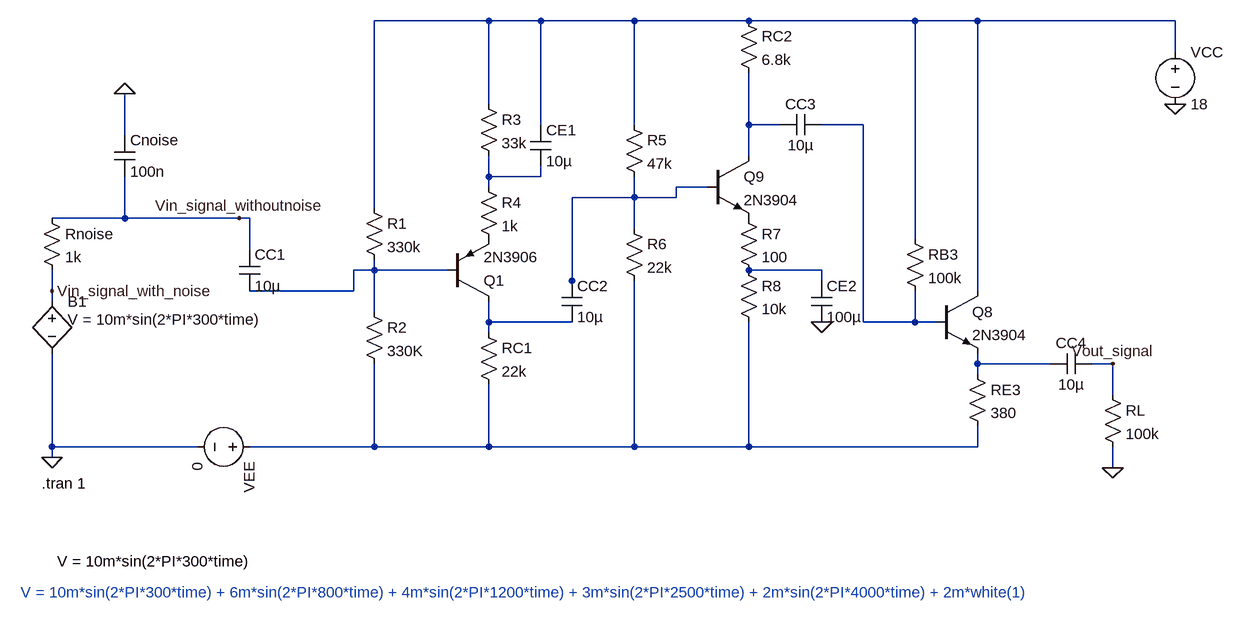
[diagram p0: schematic BJT_Audio_Amp_NoWires.asc]
BJT_Audio_Amp_NoWires.asc, the LTspice schematic file:
Version 4
SHEET 1 1736 1444
WIRE 208 80 32 80
WIRE 288 80 208 80
WIRE 432 80 288 80
WIRE 608 80 432 80
WIRE 864 80 608 80
WIRE 960 80 864 80
WIRE 1264 80 960 80
WIRE 1264 128 1264 80
WIRE 208 208 208 80
WIRE 288 240 288 80
WIRE 432 240 432 80
WIRE 608 240 608 160
WIRE 656 240 608 240
WIRE 784 240 720 240
WIRE -352 256 -352 192
WIRE 608 288 608 240
WIRE 208 320 208 288
WIRE 288 320 288 304
WIRE 288 320 208 320
WIRE 208 336 208 320
WIRE 544 336 496 336
WIRE 432 352 432 320
WIRE 432 352 336 352
WIRE 496 352 496 336
WIRE 496 352 432 352
WIRE 32 368 32 80
WIRE -352 384 -352 320
WIRE -352 384 -464 384
WIRE -176 384 -352 384
WIRE -160 384 -176 384
WIRE 432 400 432 352
WIRE 864 416 864 80
WIRE -160 432 -160 384
WIRE 32 464 32 448
WIRE 32 464 0 464
WIRE 144 464 32 464
WIRE 720 464 608 464
WIRE 336 480 336 352
WIRE 720 480 720 464
WIRE -464 496 -464 464
WIRE 0 496 0 464
WIRE 0 496 -160 496
WIRE 336 496 336 480
WIRE 960 496 960 80
WIRE -464 512 -464 496
WIRE 32 528 32 464
WIRE 208 544 208 512
WIRE 336 544 208 544
WIRE 784 544 784 240
WIRE 864 544 864 496
WIRE 864 544 784 544
WIRE 896 544 864 544
WIRE 208 560 208 544
WIRE 960 608 960 592
WIRE 1072 608 960 608
WIRE 1168 608 1136 608
WIRE 960 624 960 608
WIRE 1168 656 1168 608
WIRE -464 736 -464 592
WIRE -240 736 -464 736
WIRE 32 736 32 608
WIRE 32 736 -160 736
WIRE 208 736 208 640
WIRE 208 736 32 736
WIRE 432 736 432 480
WIRE 432 736 208 736
WIRE 608 736 608 544
WIRE 608 736 432 736
WIRE 960 736 960 704
WIRE 960 736 608 736
WIRE -464 752 -464 736
WIRE 1168 768 1168 736
FLAG 720 544 0
FLAG 1264 208 0
FLAG 1168 768 0
FLAG -464 752 0
FLAG -352 192 0
FLAG -464 496 Vin_signal_with_noise
FLAG -176 384 Vin_signal_withoutnoise
FLAG 1168 608 Vout_signal
DATAFLAG 960 368 ""
SYMBOL npn 544 288 R0
SYMATTR InstName Q9
SYMATTR Value 2N3904
SYMBOL pnp 144 512 M180
SYMATTR InstName Q1
SYMATTR Value 2N3906
SYMBOL npn 896 496 R0
SYMATTR InstName Q8
SYMATTR Value 2N3904
SYMBOL res 16 352 R0
SYMATTR InstName R1
SYMATTR Value 330k
SYMBOL res 16 512 R0
SYMATTR InstName R2
SYMATTR Value 330K
SYMBOL res 192 192 R0
SYMATTR InstName R3
SYMATTR Value 33k
SYMBOL res 192 320 R0
SYMATTR InstName R4
SYMATTR Value 1k
SYMBOL res 192 544 R0
SYMATTR InstName RC1
SYMATTR Value 22k
SYMBOL cap 272 240 R0
SYMATTR InstName CE1
SYMATTR Value 10µ
SYMBOL cap 320 480 R0
SYMATTR InstName CC2
SYMATTR Value 10µ
SYMBOL res 416 224 R0
SYMATTR InstName R5
SYMATTR Value 47k
SYMBOL res 416 384 R0
SYMATTR InstName R6
SYMATTR Value 22k
SYMBOL res 592 64 R0
SYMATTR InstName RC2
SYMATTR Value 6.8k
SYMBOL cap 720 224 R90
WINDOW 0 0 32 VBottom 2
WINDOW 3 32 32 VTop 2
SYMATTR InstName CC3
SYMATTR Value 10µ
SYMBOL res 848 400 R0
SYMATTR InstName RB3
SYMATTR Value 100k
SYMBOL res 944 608 R0
SYMATTR InstName RE3
SYMATTR Value 380
SYMBOL cap 1136 592 R90
WINDOW 0 0 32 VBottom 2
WINDOW 3 32 32 VTop 2
SYMATTR InstName CC4
SYMATTR Value 10µ
SYMBOL res 1152 640 R0
SYMATTR InstName RL
SYMATTR Value 100k
SYMBOL res 592 368 R0
SYMATTR InstName R7
SYMATTR Value 100
SYMBOL res 592 448 R0
SYMATTR InstName R8
SYMATTR Value 10k
SYMBOL cap 704 480 R0
SYMATTR InstName CE2
SYMATTR Value 100µ
SYMBOL cap -176 432 R0
SYMATTR InstName CC1
SYMATTR Value 10µ
SYMBOL res -480 368 R0
SYMATTR InstName Rnoise
SYMATTR Value 1k
SYMBOL cap -368 256 R0
SYMATTR InstName Cnoise
SYMATTR Value 100n
SYMBOL voltage 1264 112 R0
WINDOW 123 0 0 Left 0
WINDOW 39 0 0 Left 0
SYMATTR InstName VCC
SYMATTR Value 18
SYMBOL voltage -144 736 R90
WINDOW 123 0 0 Left 0
WINDOW 39 0 0 Left 0
SYMATTR InstName VEE
SYMATTR Value 0
SYMBOL bv -464 496 R0
WINDOW 3 24 44 Left 2
SYMATTR Value V = 10m*sin(2*PI*300*time)
SYMATTR InstName B1
TEXT -480 792 Left 2 !.tran 1
TEXT -456 912 Left 2 !V = 10m*sin(2*PI*300*time)
TEXT -512 960 Left 2 ;V = 10m*sin(2*PI*300*time) + 6m*sin(2*PI*800*time) + 4m*sin(2*PI*1200*time) + 3m*sin(2*PI*2500*time) + 2m*sin(2*PI*4000*time) + 2m*white(1)

The netlist it stands for:
* BJT_Audio_Amp_NoWires.asc
Q9 N002 N005 P001 0 2N3904
Q1 N008 N006 P002 0 2N3906
Q8 N001 N003 N009 0 2N3904
R1 N001 N006 330k
R2 N006 N010 330K
R3 N001 N004 33k
R4 N004 P002 1k
RC1 N008 N010 22k
CE1 N001 N004 10µ
CC2 N005 N008 10µ
R5 N001 N005 47k
R6 N005 N010 22k
RC2 N001 N002 6.8k
CC3 N003 N002 10µ
RB3 N001 N003 100k
RE3 N009 N010 380
CC4 Vout_signal N009 10µ
RL Vout_signal 0 100k
R7 P001 N007 100
R8 N007 N010 10k
CE2 N007 0 100µ
CC1 Vin_signal_withoutnoise N006 10µ
Rnoise Vin_signal_withoutnoise Vin_signal_with_noise 1k
Cnoise 0 Vin_signal_withoutnoise 100n
VCC N001 0 18
VEE N010 0 0
B1 Vin_signal_with_noise 0 V = 10m*sin(2*PI*300*time)
.model NPN NPN
.model PNP PNP
.lib standard.bjt
.tran 1
V = 10m*sin(2*PI*300*time)
* V = 10m*sin(2*PI*300*time) + 6m*sin(2*PI*800*time) + 4m*sin(2*PI*1200*time) + 3m*sin(2*PI*2500*time) + 2m*sin(2*PI*4000*time) + 2m*white(1)
.backanno
.end